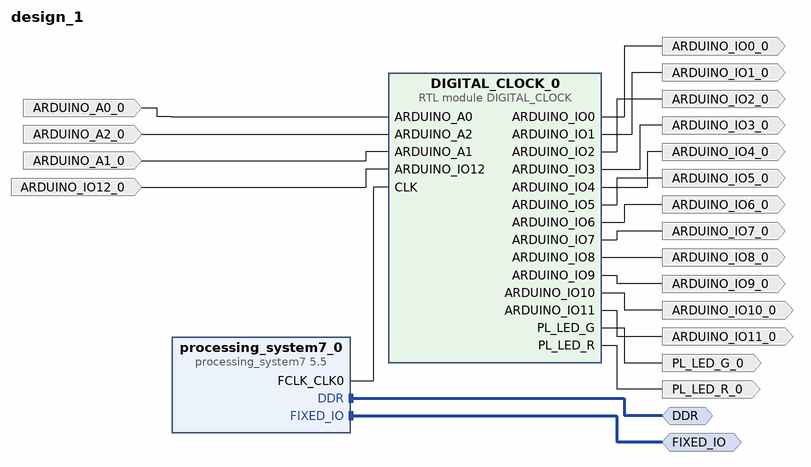
[diagram p0: block diagram of the top level]
# Vivado block design design_1, xc7z007sclg225-1, Vivado 2019.1
create_bd_design design_1

create_bd_intf_port -mode Master -vlnv xilinx.com:interface:ddrx_rtl:1.0 DDR
create_bd_intf_port -mode Master -vlnv xilinx.com:display_processing_system7:fixedio_rtl:1.0 FIXED_IO
create_bd_port -dir O ARDUINO_IO11_0
create_bd_port -dir O ARDUINO_IO2_0
create_bd_port -dir O PL_LED_G_0
create_bd_port -dir O ARDUINO_IO7_0
create_bd_port -dir O ARDUINO_IO1_0
create_bd_port -dir O ARDUINO_IO4_0
create_bd_port -dir I ARDUINO_A0_0
create_bd_port -dir O PL_LED_R_0
create_bd_port -dir O ARDUINO_IO6_0
create_bd_port -dir I ARDUINO_A2_0
create_bd_port -dir O ARDUINO_IO5_0
create_bd_port -dir I ARDUINO_A1_0
create_bd_port -dir I ARDUINO_IO12_0
create_bd_port -dir O ARDUINO_IO0_0
create_bd_port -dir O ARDUINO_IO3_0
create_bd_port -dir O ARDUINO_IO10_0
create_bd_port -dir O ARDUINO_IO9_0
create_bd_port -dir O ARDUINO_IO8_0

create_bd_cell -type ip -vlnv xilinx.com:ip:processing_system7:5.5 processing_system7_0
set_property -dict [list \
  CONFIG.PCW_APU_PERIPHERAL_FREQMHZ 666.666666 \
  CONFIG.PCW_DM_WIDTH 2 \
  CONFIG.PCW_DQS_WIDTH 2 \
  CONFIG.PCW_DQ_WIDTH 16 \
  CONFIG.PCW_ENET0_PERIPHERAL_ENABLE 0 \
  CONFIG.PCW_FCLK0_PERIPHERAL_CLKSRC {ARM PLL} \
  CONFIG.PCW_FPGA0_PERIPHERAL_FREQMHZ 50 \
  CONFIG.PCW_FPGA1_PERIPHERAL_FREQMHZ 100 \
  CONFIG.PCW_GPIO_EMIO_GPIO_ENABLE 1 \
  CONFIG.PCW_GPIO_EMIO_GPIO_IO 16 \
  CONFIG.PCW_GPIO_EMIO_GPIO_WIDTH 16 \
  CONFIG.PCW_GPIO_MIO_GPIO_ENABLE 1 \
  CONFIG.PCW_GPIO_MIO_GPIO_IO MIO \
  CONFIG.PCW_I2C0_I2C0_IO EMIO \
  CONFIG.PCW_I2C0_PERIPHERAL_ENABLE 1 \
  CONFIG.PCW_I2C_PERIPHERAL_FREQMHZ 111.111115 \
  CONFIG.PCW_I2C_RESET_ENABLE 1 \
  CONFIG.PCW_I2C_RESET_SELECT {Share reset pin} \
  CONFIG.PCW_MIO_PRIMITIVE 32 \
  CONFIG.PCW_PRESET_BANK1_VOLTAGE {LVCMOS 3.3V} \
  CONFIG.PCW_QSPI_GRP_FBCLK_ENABLE 1 \
  CONFIG.PCW_QSPI_GRP_FBCLK_IO {MIO 8} \
  CONFIG.PCW_QSPI_GRP_SINGLE_SS_ENABLE 1 \
  CONFIG.PCW_QSPI_GRP_SINGLE_SS_IO {MIO 1 .. 6} \
  CONFIG.PCW_QSPI_PERIPHERAL_ENABLE 1 \
  CONFIG.PCW_QSPI_QSPI_IO {MIO 1 .. 6} \
  CONFIG.PCW_SD0_PERIPHERAL_ENABLE 1 \
  CONFIG.PCW_SD0_SD0_IO EMIO \
  CONFIG.PCW_SD1_PERIPHERAL_ENABLE 1 \
  CONFIG.PCW_SD1_SD1_IO {MIO 10 .. 15} \
  CONFIG.PCW_SDIO_PERIPHERAL_FREQMHZ 25 \
  CONFIG.PCW_SINGLE_QSPI_DATA_MODE x4 \
  CONFIG.PCW_UART0_GRP_FULL_ENABLE 1 \
  CONFIG.PCW_UART0_GRP_FULL_IO EMIO \
  CONFIG.PCW_UART0_PERIPHERAL_ENABLE 1 \
  CONFIG.PCW_UART0_UART0_IO EMIO \
  CONFIG.PCW_UART1_PERIPHERAL_ENABLE 1 \
  CONFIG.PCW_UART1_UART1_IO {MIO 48 .. 49} \
  CONFIG.PCW_UART_PERIPHERAL_FREQMHZ 100 \
  CONFIG.PCW_UIPARAM_DDR_BUS_WIDTH {16 Bit} \
  CONFIG.PCW_UIPARAM_DDR_FREQ_MHZ 533.333333 \
  CONFIG.PCW_UIPARAM_DDR_MEMORY_TYPE {DDR 3 (Low Voltage)} \
  CONFIG.PCW_UIPARAM_DDR_PARTNO {MT41K256M16 RE-125} \
  CONFIG.PCW_USB0_PERIPHERAL_ENABLE 1 \
  CONFIG.PCW_USB0_RESET_ENABLE 1 \
  CONFIG.PCW_USB0_RESET_IO {MIO 7} \
  CONFIG.PCW_USB0_USB0_IO {MIO 28 .. 39} \
  CONFIG.PCW_USB_RESET_ENABLE 1 \
  CONFIG.PCW_USB_RESET_SELECT {Share reset pin} \
  CONFIG.PCW_USE_M_AXI_GP0 0 \
] [get_bd_cells processing_system7_0]
# 317 more settings of processing_system7_0 are not shown: defaults, MIO pin electricals, DDR timing, and values the tool derives
create_bd_cell -type module -reference DIGITAL_CLOCK DIGITAL_CLOCK_0

# ---- connections ----

connect_bd_intf_net [get_bd_intf_ports DDR] [get_bd_intf_pins processing_system7_0/DDR]
connect_bd_intf_net [get_bd_intf_ports FIXED_IO] [get_bd_intf_pins processing_system7_0/FIXED_IO]
connect_bd_net [get_bd_pins processing_system7_0/FCLK_CLK0] [get_bd_pins DIGITAL_CLOCK_0/CLK]
connect_bd_net [get_bd_pins DIGITAL_CLOCK_0/ARDUINO_IO11] [get_bd_ports ARDUINO_IO11_0]
connect_bd_net [get_bd_pins DIGITAL_CLOCK_0/ARDUINO_IO2] [get_bd_ports ARDUINO_IO2_0]
connect_bd_net [get_bd_pins DIGITAL_CLOCK_0/PL_LED_G] [get_bd_ports PL_LED_G_0]
connect_bd_net [get_bd_pins DIGITAL_CLOCK_0/ARDUINO_IO7] [get_bd_ports ARDUINO_IO7_0]
connect_bd_net [get_bd_pins DIGITAL_CLOCK_0/ARDUINO_IO1] [get_bd_ports ARDUINO_IO1_0]
connect_bd_net [get_bd_pins DIGITAL_CLOCK_0/ARDUINO_IO4] [get_bd_ports ARDUINO_IO4_0]
connect_bd_net -net ARDUINO_A0_0_1 [get_bd_ports ARDUINO_A0_0] [get_bd_pins DIGITAL_CLOCK_0/ARDUINO_A0]
connect_bd_net [get_bd_pins DIGITAL_CLOCK_0/PL_LED_R] [get_bd_ports PL_LED_R_0]
connect_bd_net [get_bd_pins DIGITAL_CLOCK_0/ARDUINO_IO6] [get_bd_ports ARDUINO_IO6_0]
connect_bd_net -net ARDUINO_A2_0_1 [get_bd_ports ARDUINO_A2_0] [get_bd_pins DIGITAL_CLOCK_0/ARDUINO_A2]
connect_bd_net [get_bd_pins DIGITAL_CLOCK_0/ARDUINO_IO5] [get_bd_ports ARDUINO_IO5_0]
connect_bd_net -net ARDUINO_A1_0_1 [get_bd_ports ARDUINO_A1_0] [get_bd_pins DIGITAL_CLOCK_0/ARDUINO_A1]
connect_bd_net -net ARDUINO_IO12_0_1 [get_bd_ports ARDUINO_IO12_0] [get_bd_pins DIGITAL_CLOCK_0/ARDUINO_IO12]
connect_bd_net [get_bd_pins DIGITAL_CLOCK_0/ARDUINO_IO0] [get_bd_ports ARDUINO_IO0_0]
connect_bd_net [get_bd_pins DIGITAL_CLOCK_0/ARDUINO_IO3] [get_bd_ports ARDUINO_IO3_0]
connect_bd_net [get_bd_pins DIGITAL_CLOCK_0/ARDUINO_IO10] [get_bd_ports ARDUINO_IO10_0]
connect_bd_net [get_bd_pins DIGITAL_CLOCK_0/ARDUINO_IO9] [get_bd_ports ARDUINO_IO9_0]
connect_bd_net [get_bd_pins DIGITAL_CLOCK_0/ARDUINO_IO8] [get_bd_ports ARDUINO_IO8_0]

validate_bd_design
save_bd_design
